# Altium schematic sheet 5V_1A_Max.SchDoc
size A
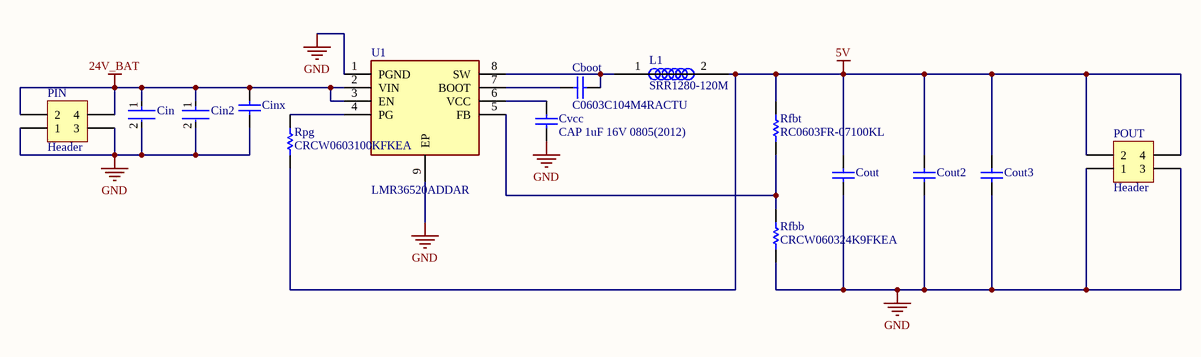
[diagram p0: 5V_1A_Max.SchDoc]

## Parts
Cboot  C0603C104M4RACTU  [CAPC1608X87X35ML15T15]
Cin  C2012X5R1H475K125AB  [FP-C2012-125-MFG]  (value not drawn)
Cin2  C2012X5R1H475K125AB  [FP-C2012-125-MFG]  (value not drawn)
Cinx  GRM21BR71H224MA01L  [CAPC2013X135X45ML10T25]  (value not drawn)
Cout  GRM32ER61C476KE15L  [MURA-1210_H_2.7_L]  (value not drawn)
Cout2  GRM32ER61C476KE15L  [MURA-1210_H_2.7_L]  (value not drawn)
Cout3  GRM32ER61C476KE15L  [MURA-1210_H_2.7_L]  (value not drawn)
Cvcc  CAP 1uF 16V 0805(2012)  [CAPC0805(2012)100_N]
L1  SRR1280-120M  [SRR1280-120M]
PIN  Header  [MINIFITJR 2X2]
POUT  Header  [MINIFITJR 2X2]
Rfbb  CRCW060324K9FKEA  [RESC1609X50X30NL10T20]
Rfbt  RC0603FR-07100KL  [RESC1608X55X25ML10T15]
Rpg  CRCW0603100KFKEA  [RESC1609X50X30LL10T20]
U1  LMR36520ADDAR  [SOIC127P600X170-9N]

## Nets
5V: Cout.2 Cout2.2 Cout3.2 L1.2 POUT.2 POUT.4 Rfbt.2 Rpg.1
24V_BAT: Cin.1 Cin2.1 Cinx.2 PIN.2 PIN.4 U1.2(VIN) U1.3(EN)
GND: Cin.2 Cin2.2 Cinx.1 Cout.1 Cout2.1 Cout3.1 Cvcc.1 PIN.1 PIN.3 POUT.1 POUT.3 Rfbb.1 U1.1(PGND) U1.9(EP)
NetCboot_1: Cboot.1 U1.7(BOOT)
NetCboot_2: Cboot.2 L1.1 U1.8(SW)
NetCvcc_2: Cvcc.2 U1.6(VCC)
NetRfbb_2: Rfbb.2 Rfbt.1 U1.5(FB)
NetRpg_2: Rpg.2 U1.4(PG)

## Library data of the parts
Cboot = CMP-2006-03067-1: Manufacturer: Kemet; Part Number: C0603C104M4RACTU
Cin Cin2 = CMP-08246-000007-1: CAP CER 4.7UF 50V X5R 0805; Manufacturer: TDK Corporation; Tolerance: 10%; Temperature Coefficient: 15%; Mouser Description: Multilayer Ceramic Capacitors MLCC - SMD/SMT 0805 4.7uF 50volts X5R 10%; Manufacturer Part Number: C2012X5R1H475K125AB; Category: Cap; Temperature Range High: +85°C; Digikey Description: CAP CER 4.7UF 50V X5R 0805; Voltage Rating: 50V; Device Class L1: Passive Components; Temperature Range Low: -55°C; Lead Free: Yes; ComponentLink2Description: Datasheet; Capacitance: 4.7uF; Octopart: https://octopart.com/c2012x5r1h475k125ab-tdk-25947720; Device Class L2: Capacitors; Value: 4.7uF; Temperature: -55°C to +85°C; ComponentLink2URL: https://product.tdk.com/info/en/catalog/datasheets/mlcc_commercial_general_en.pdf; RoHS: TRUE; Height: 1.45mm; Temperature Characteristic: X5R; Material: Ceramic; Package: C2012-125; Device Class L3: Ceramic Capacitors; Automotive: No
Cinx = CMP-2007-03584-1: Manufacturer: Murata; Part Number: GRM21BR71H224MA01L
Cout Cout2 Cout3 = CMP-2000-06362-1: Cap Ceramic, 47 uF, +/- 10%, -55 to 85 degC, 2-Pin SMD (1210), RoHS, Tape and Reel; Manufacturer: Murata; Catalog Drawings: GRMSeries_1210_2.5; Voltage Rating DC: 16V; Capacitance: 47µF; Product Training Modules: High-CapMultilayerCeramicCapacitors; Temperature Coefficient: X5R; Online Catalog: GRMSeries; Other Names: 490-6539-6; Lead Style: -; Datasheet URL: http://psearch.en.murata.com/capacitor/product/GRM32ER61C476KE15%23.pdf; Package Description: 2-Pin Surface Mount Device, Body 3.2 x 2.5 mm; Applications: GeneralPurpose; Thickness (Max): 0.106"(2.70mm); Operating Temperature: -55°C~85°C; Mounting Technology: SurfaceMount; Category: Capacitors; Package / Case: 1210(3225Metric); Mounting Type: SurfaceMount,MLCC; Ratings: -; Package Reference: 1210; Height - Seated (Max): -; Series: GRM; Lead Spacing: -; Family: CeramicCapacitors; Datasheet Version: 04/2016; Tolerance: ±10%; Size / Dimension: 0.126"Lx0.098"W(3.20mmx2.50mm); Packaging: Digi-Reel®; Voltage - Rated: 16V; Standard Package: 1; Features: -; Manufacturer URL: http://www.murata.com/
Cvcc = CMP-1036-04747-1: CAP 1uF 16V ±10% 0805 (2012 Metric) Thickness 1mm SMD; Tolerance: Â±10%; Case-Metric: 2012; Case-EIA: 0805; Technology: SMT; Value: 1uF; Rated Voltage: 16 V; Max Thickness: 1 mm
PIN POUT = MiniFit Jr 2x2: Header, 2x2
Rfbb = CMP-2000-03121-1: Manufacturer: Vishay Dale; Part Number: CRCW060324K9FKEA
Rfbt = CMP-2100-03662-1: Chip Resistor, 100 KOhm, +/- 1%, 0.1 W, -55 to 155 degC, 0603 (1608 Metric), RoHS, Tape and Reel; Manufacturer: Yageo; Power Rating: 100mW; Voltage Rating: 50V; Temperature Coefficient: 100ppm/degreesC; Datasheet Version: Rev. 5, 10/2016; Height: 0.45mm; Lead Free: LeadFree; Manufacturer URL: http://www.yageo.com/; Package Reference: 0603; Depth: 0.8mm; RoHSCompliant: true; Composition: ThickFilm; Military Standard: Not; Resistance: 100KOhm; Case/Package: 0603; Packaging: TapeandReel; Case Code (Imperial): 0603; Voltage Rating (DC): 50V; Case Code (Metric): 1608; Tolerance: 1%; Termination: SMD/SMT; Min Operating Temperature: -55degC; Number of Pins: 2; Length: 1.6mm; Width: 0.8mm; Datasheet URL: http://www.yageo.com/NewPortal/yageodocoutput?fileName=/pdf/R-Chip/PYu-RC_Group_51_RoHS_L_5.pdf; Package Description: 2-Pin Surface Mount Device, Body 1.6 x 0.8 mm; Max Operating Temperature: 155degC; REACH SVHC: NoSVHC
Rpg = CMP-2000-03820-1: Manufacturer: Vishay Dale; Part Number: CRCW0603100KFKEA
U1 = LMR36520ADDAR: Integrated Circuit; Manufacturer_Name: Texas Instruments; Datasheet Link: http://www.ti.com/general/docs/suppproductinfo.tsp?distId=10&gotoUrl=http%3A%2F%2Fwww.ti.com%2Flit%2Fgpn%2Flmr36520; Height: 1.7mm; Manufacturer_Part_Number: LMR36520ADDAR; Arrow Part Number: LMR36520ADDAR; Arrow Price/Stock: https://www.arrow.com/en/products/lmr36520addar/texas-instruments; Mouser Part Number: 595-LMR36520ADDAR; Mouser Price/Stock: https://www.mouser.co.uk/ProductDetail/Texas-Instruments/LMR36520ADDAR?qs=vHuUswq2%252Bsxe%2FiIOFannaw%3D%3D